# Altium schematic sheet Row.SchDoc
size A4
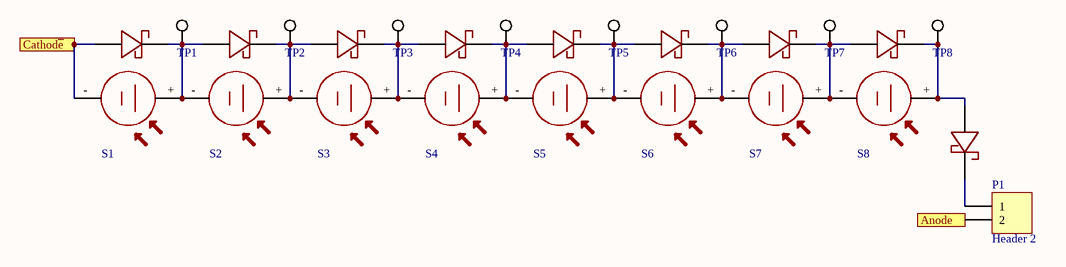
[diagram p0: Row.SchDoc]

## Parts
D1  SCHOTTKY_DIODE_B120-FDICT-NDSCHOTTKY_DIODE_B120-FDICT-ND  [SB_DIODE]  (value not drawn)
D2  SCHOTTKY_DIODE_B120-FDICT-NDSCHOTTKY_DIODE_B120-FDICT-ND  [SB_DIODE]  (value not drawn)
D3  SCHOTTKY_DIODE_B120-FDICT-NDSCHOTTKY_DIODE_B120-FDICT-ND  [SB_DIODE]  (value not drawn)
D4  SCHOTTKY_DIODE_B120-FDICT-NDSCHOTTKY_DIODE_B120-FDICT-ND  [SB_DIODE]  (value not drawn)
D5  SCHOTTKY_DIODE_B120-FDICT-NDSCHOTTKY_DIODE_B120-FDICT-ND  [SB_DIODE]  (value not drawn)
D6  SCHOTTKY_DIODE_B120-FDICT-NDSCHOTTKY_DIODE_B120-FDICT-ND  [SB_DIODE]  (value not drawn)
D7  SCHOTTKY_DIODE_B120-FDICT-NDSCHOTTKY_DIODE_B120-FDICT-ND  [SB_DIODE]  (value not drawn)
D8  SCHOTTKY_DIODE_B120-FDICT-NDSCHOTTKY_DIODE_B120-FDICT-ND  [SB_DIODE]  (value not drawn)
D9  SCHOTTKY_DIODE_B120-FDICT-NDSCHOTTKY_DIODE_B120-FDICT-ND  [SB_DIODE]  (value not drawn)
P1  Header 2  [HDR1X2]
S1  SOLAR_CELL  [SOLAR_CELL]  (value not drawn)
S2  SOLAR_CELL  [SOLAR_CELL]  (value not drawn)
S3  SOLAR_CELL  [SOLAR_CELL]  (value not drawn)
S4  SOLAR_CELL  [SOLAR_CELL]  (value not drawn)
S5  SOLAR_CELL  [SOLAR_CELL]  (value not drawn)
S6  SOLAR_CELL  [SOLAR_CELL]  (value not drawn)
S7  SOLAR_CELL  [SOLAR_CELL]  (value not drawn)
S8  SOLAR_CELL  [SOLAR_CELL]  (value not drawn)
TP1  TEST_POINT  [TEST_POINT]  (value not drawn)
TP2  TEST_POINT  [TEST_POINT]  (value not drawn)
TP3  TEST_POINT  [TEST_POINT]  (value not drawn)
TP4  TEST_POINT  [TEST_POINT]  (value not drawn)
TP5  TEST_POINT  [TEST_POINT]  (value not drawn)
TP6  TEST_POINT  [TEST_POINT]  (value not drawn)
TP7  TEST_POINT  [TEST_POINT]  (value not drawn)
TP8  TEST_POINT  [TEST_POINT]  (value not drawn)

## Ports
Anode, Cathod~{e}

## Nets
Anode: P1.2 ; port Anode
Cathod~{e}: D1.POS S1.- ; port Cathod~{e}
NetD1_NEG: D1.NEG D2.POS S1.+ S2.- TP1.38
NetD2_NEG: D2.NEG D3.POS S2.+ S3.- TP2.38
NetD3_NEG: D3.NEG D4.POS S3.+ S4.- TP3.38
NetD4_NEG: D4.NEG D5.POS S4.+ S5.- TP4.38
NetD5_NEG: D5.NEG D6.POS S5.+ S6.- TP5.38
NetD6_NEG: D6.NEG D7.POS S6.+ S7.- TP6.38
NetD7_NEG: D7.NEG D8.POS S7.+ S8.- TP7.38
NetD8_NEG: D8.NEG D9.POS S8.+ TP8.38
NetD9_NEG: D9.NEG P1.1

## Library data of the parts
D1-D9 = SCHOTTKY_DIODE_B120-FDICT-NDSCHOTTKY_DIODE_B120-FDICT-ND: GateName_1: G$1; SymbolName_1: SCHOTTKY_DIODE_B120-FDICT-ND; DeviceName: SCHOTTKY_DIODE_B120-FDICT-ND; LibraryName: Solar_Fadi; DeviceSetName: SCHOTTKY_DIODE_B120-FDICT-ND; Package: SCHOTTKY_DIODE_B120-FDICT-ND
P1 = Header 2: Header, 2-Pin; LatestRevisionDate: 17-Jul-2002; LatestRevisionNote: Re-released for DXP Platform.; Publisher: Altium Limited
S1-S8 = SOLAR_CELL: pin to pad: +>POS ->NEG
TP1-TP8 = TEST_POINT: pin to pad: 38>PAD